# EAGLE schematic orb (EAGLE 4.16)
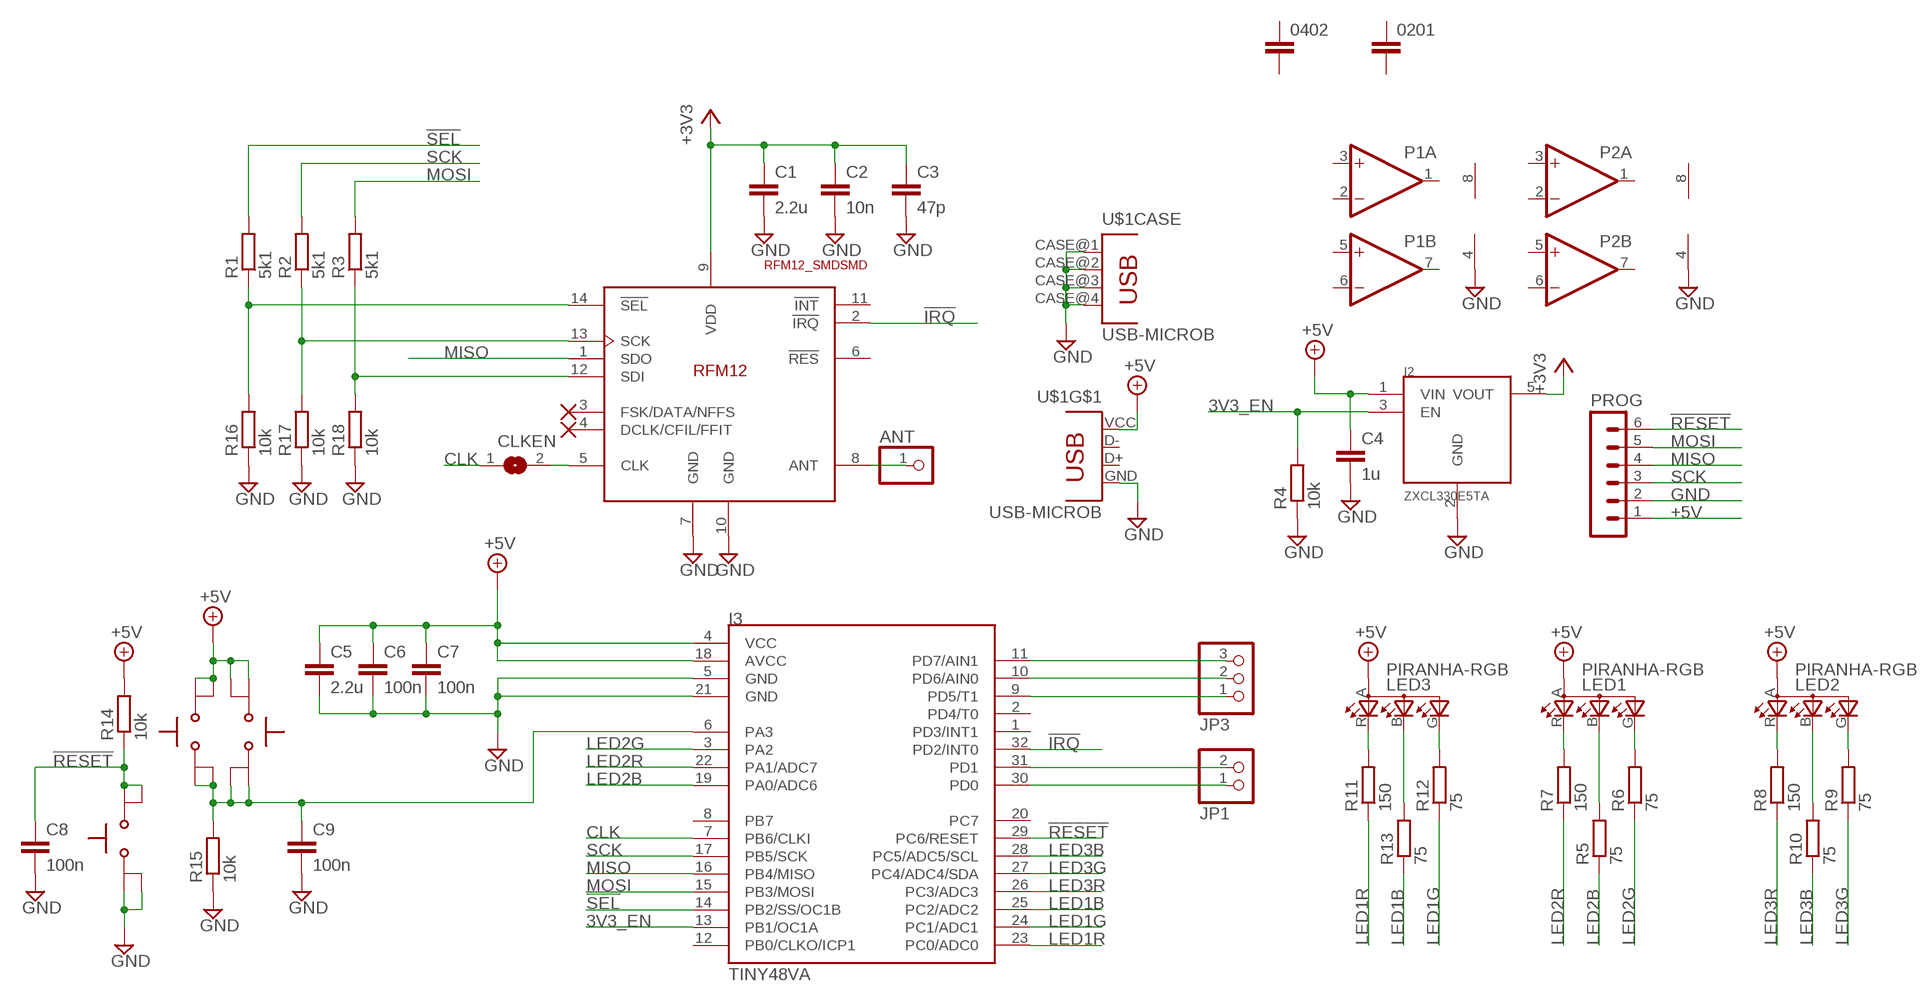
[diagram p0: schematic, sheet 1]

## Parts
0201  C-EUC0201  [C0201]
0402  C-EUC0402  [C0402]
ANT  PINHD-1X1  [1X01]
C1  2.2u  C-EUC1206  [C1206]
C2  10n  C-EUC0603  [C0603]
C3  47p  C-EUC0603  [C0603]
C4  1u  C-EUC0603  [C0603]
C5  2.2u  C-EUC1206  [C1206]
C6  100n  C-EUC0805  [C0805]
C7  100n  C-EUC0805  [C0805]
C8  100n  C-EUC0805  [C0805]
C9  100n  C-EUC0805  [C0805]
CLKEN  SJ  [SJ]
I1  RFM12_SMDSMD  [RFM12]
I2  ZXCL330E5TA  [SOT23-5L]
I3  TINY48VA  [TQFP32-08]
JP1  PINHD-1X2  [1X02]
JP3  PINHD-1X3  [1X03]
LED1  PIRANHA-RGB  [5MM-SUPERFLUX]
LED2  PIRANHA-RGB  [5MM-SUPERFLUX]
LED3  PIRANHA-RGB  [5MM-SUPERFLUX]
P1  LM1458D  [SO08]
P2  LM1458D  [SO08]
PROG  MA06-1  [MA06-1]
R1  5k1  R-EU_R0603  [R0603]
R2  5k1  R-EU_R0603  [R0603]
R3  5k1  R-EU_R0603  [R0603]
R4  10k  R-EU_R0603  [R0603]
R5  75  R-EU_R0805  [R0805]
R6  75  R-EU_R0805  [R0805]
R7  150  R-EU_R0805  [R0805]
R8  150  R-EU_R0805  [R0805]
R9  75  R-EU_R0805  [R0805]
R10  75  R-EU_R0805  [R0805]
R11  150  R-EU_R0805  [R0805]
R12  75  R-EU_R0805  [R0805]
R13  75  R-EU_R0805  [R0805]
R14  10k  R-EU_R0603  [R0603]
R15  10k  R-EU_R0603  [R0603]
R16  10k  R-EU_R0603  [R0603]
R17  10k  R-EU_R0603  [R0603]
R18  10k  R-EU_R0603  [R0603]
U$1  USB-MICROB  [ZX62-B-5PA]
U$2  SWITCH2-4  [KMR4]
U$3  SWITCH2-4  [KMR4]
U$4  SWITCH2-4  [KMR4]

## Nets
3V3_EN: I2.3(EN) I3.13(PB1/OC1A) R4.2
!IRQ: I1.2(!IRQ) I3.32(PD2/INT0)
!RESET: C8.1 I3.29(PC6/RESET) PROG.6 R14.1 U$2.2 U$2.3
!SEL: I3.14(PB2/SS/OC1B) R1.2
+3V3: C1.1 C2.1 C3.1 I1.9(VDD) I2.5(VOUT)
+5V: C4.1 C5.1 C6.1 C7.1 I2.1(VIN) I3.4(VCC) I3.18(AVCC) LED1.A(A2) LED2.A(A2) LED3.A(A2) PROG.1 R14.2 U$1.VCC U$3.2 U$3.3 U$4.2 U$4.3
CLK: CLKEN.1 I3.7(PB6/CLKI)
GND: C1.2 C2.2 C3.2 C4.2 C5.2 C6.2 C7.2 C8.2 C9.2 I1.7(GND) I1.10(GND) I2.2(GND) I3.5(GND) I3.21(GND) P1.4(P:V-) P2.4(P:V-) PROG.2 R4.1 R15.1 R16.1 R17.1 R18.1 U$1.CASE@1 U$1.CASE@2 U$1.CASE@3 U$1.CASE@4 U$1.GND U$2.1 U$2.4
LED1B: I3.25(PC2/ADC2) R13.1
LED1G: I3.24(PC1/ADC1) R12.1
LED1R: I3.23(PC0/ADC0) R11.1
LED2B: I3.19(PA0/ADC6) R5.1
LED2G: I3.3(PA2) R6.1
LED2R: I3.22(PA1/ADC7) R7.1
LED3B: I3.28(PC5/ADC5/SCL) R10.1
LED3G: I3.27(PC4/ADC4/SDA) R9.1
LED3R: I3.26(PC3/ADC3) R8.1
MISO: I1.1(SDO) I3.16(PB4/MISO) PROG.4
MOSI: I3.15(PB3/MOSI) PROG.5 R3.2
N$1: LED3.R(CRED) R11.2
N$2: LED3.B(CBLUE) R13.2
N$3: LED3.G(CGREEN) R12.2
N$4: LED1.R(CRED) R7.2
N$5: LED1.B(CBLUE) R5.2
N$6: LED1.G(CGREEN) R6.2
N$7: LED2.R(CRED) R8.2
N$8: LED2.B(CBLUE) R10.2
N$9: LED2.G(CGREEN) R9.2
N$10: CLKEN.2 I1.5(CLK)
N$11: I3.31(PD1) JP1.2
N$12: I3.30(PD0) JP1.1
N$13: I3.9(PD5/T1) JP3.1
N$14: I3.10(PD6/AIN0) JP3.2
N$15: I3.11(PD7/AIN1) JP3.3
N$19: ANT.1 I1.8(ANT)
N$20: I1.14(!SEL) R1.1 R16.2
N$21: I1.13(SCK) R2.1 R17.2
N$22: C9.1 I3.6(PA3) R15.2 U$3.1 U$3.4 U$4.1 U$4.4
N$23: I1.12(SDI) R3.1 R18.2
SCK: I3.17(PB5/SCK) PROG.3 R2.2
Unconnected: 0201.1 0201.2 0402.1 0402.2 I1.3(FSK/DATA/NFFS) I1.4(DCLK/CFIL/FFIT) I1.6(!RES) I1.11(!INT) I3.1(PD3/INT1) I3.2(PD4/T0) I3.8(PB7) I3.12(PB0/CLKO/ICP1) I3.20(PC7) P1.1(A:OUT) P1.2(A:-IN) P1.3(A:+IN) P1.5(B:+IN) P1.6(B:-IN) P1.7(B:OUT) P2.1(A:OUT) P2.2(A:-IN) P2.3(A:+IN) P2.5(B:+IN) P2.6(B:-IN) P2.7(B:OUT) U$1.D+ U$1.D-

## Power pins joined to a net without a drawn wire
V+: P1.8(P:V+) P2.8(P:V+)

## Library data of the parts
0201 0402 C1-C9 = rcl:C-EU: CAPACITOR, European symbol
ANT = pinhead:PINHD-1X1: PIN HEADER
CLKEN = jumper:SJ: SMD solder JUMPER
I1 = orb:RFM12_SMD: RFM12 is a low costing ISM band transceiver module implemented with unique PLL. It works signal ranges from 315/433/868/915MHZ bands, comply with FCC, ETSI regulation. The SPI interface is used to communicate with microcontroller for parameter setting.
I2 = orb:ZXCL330E5TA
I3 = orb:TINY48: MICROCONTROLLER 1.8 V 2 Kbytes FLASH
JP1 = pinhead:PINHD-1X2: PIN HEADER
JP3 = pinhead:PINHD-1X3: PIN HEADER
LED1-LED3 = orb:PIRANHA-RGB
P1 P2 = linear:*1458: OP AMP
PROG = orb:MA06-1: PIN HEADER
R1-R18 = rcl:R-EU_: RESISTOR, European symbol
U$1 = orb:USB-MICROB
U$2-U$4 = orb:SWITCH2-4